# Altium schematic sheet FET Channel.SchDoc
size A
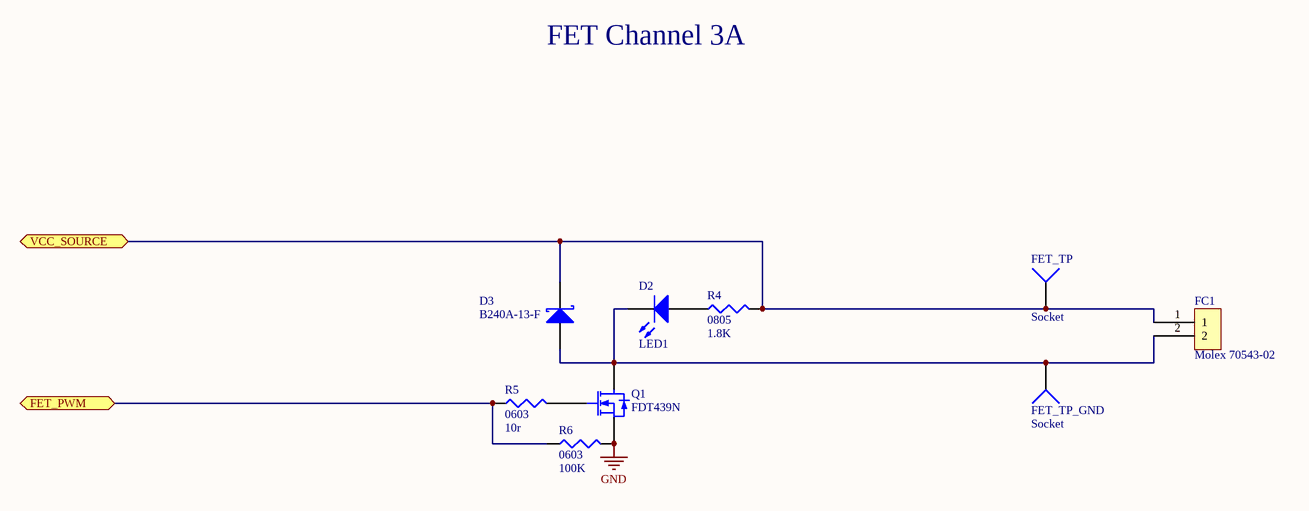
[diagram p0: FET Channel.SchDoc]

## Parts
D2  LED1  [SM 0805 polarized]
D3  B240A-13-F  [SMB]
FC1  Molex 70543-02  [70543-02]
FET_TP  Socket  [PIN1]
FET_TP_GND  Socket  [PIN1]
Q1  FDT439N  [Fairchild FDT439N]
R4  0805  value 1.8K  [SM 0805 - gap trimmed]
R5  0603  value 10r  [J1-0603]
R6  0603  value 100K  [J1-0603]

## Ports
FET_PWM, VCC_SOURCE

## Nets
2: Q1.4(D)
GND: Q1.3(S) R6.2
FET_PWM: R5.1 R6.1 ; port FET_PWM
VCC_SOURCE: D3.2(K) FC1.1 FET_TP.1 R4.2 ; port VCC_SOURCE
NetD2_1: D2.1(A) R4.1
NetD2_2: D2.2(K) D3.1(A) FC1.2 FET_TP_GND.1 Q1.2(D)
NetQ1_1: Q1.1(G) R5.2

## Notes on the sheet
- FET Channel 3A

## Library data of the parts
D2 = LED1: Typical RED GaAs LED; Published: 8-Jun-2000; LatestRevisionDate: 08-Jul-2005; LatestRevisionNote: Mech Layer 1 removed.; PackageReference: LED-1; Publisher: Altium Limited; PackageDescription: LED; 2 Leads
D3 = D Schottky: Schottky Diode; Published: 8-Jun-2000; LatestRevisionDate: 17-Jul-2002; LatestRevisionNote: Re-released for DXP Platform.; PackageReference: SMB; Publisher: Altium Limited; PackageDescription: DO-214-AA/SMB; 2 C-Bend Leads; Body 5.3 x 3.6 mm, inc. leads (LxW); Code_JEDEC: DO-214-AA
Q1 = Fairchild FDT439N: N-Channel MOSFET; Published: 8-Jun-2000; LatestRevisionDate: 17-Jul-2002; LatestRevisionNote: Re-released for DXP Platform.; PackageVersion: 1995/1996; PackageReference: E3; Publisher: Altium Limited; PackageDescription: TO, Flat Index; 3 In-Line, Axial Leads; Body Dia. 4.6mm; Lead Dia. 0.5 mm (max)
R4-R6 = Res3: Resistor; Published: 8-Jun-2000; LatestRevisionDate: 29-May-2009; LatestRevisionNote: IPC-7351 Footprint Added.; PackageReference: J1-0603; Publisher: Altium Limited; PackageDescription: Chip Resistor
FET_TP FET_TP_GND = Socket: LatestRevisionDate: 17-Jul-2002; LatestRevisionNote: Re-released for DXP Platform.; Publisher: Altium Limited